# Altium schematic sheet Controls_Architecture.SchDoc
size Letter; SheetNumber: 11; SheetTotal: 13
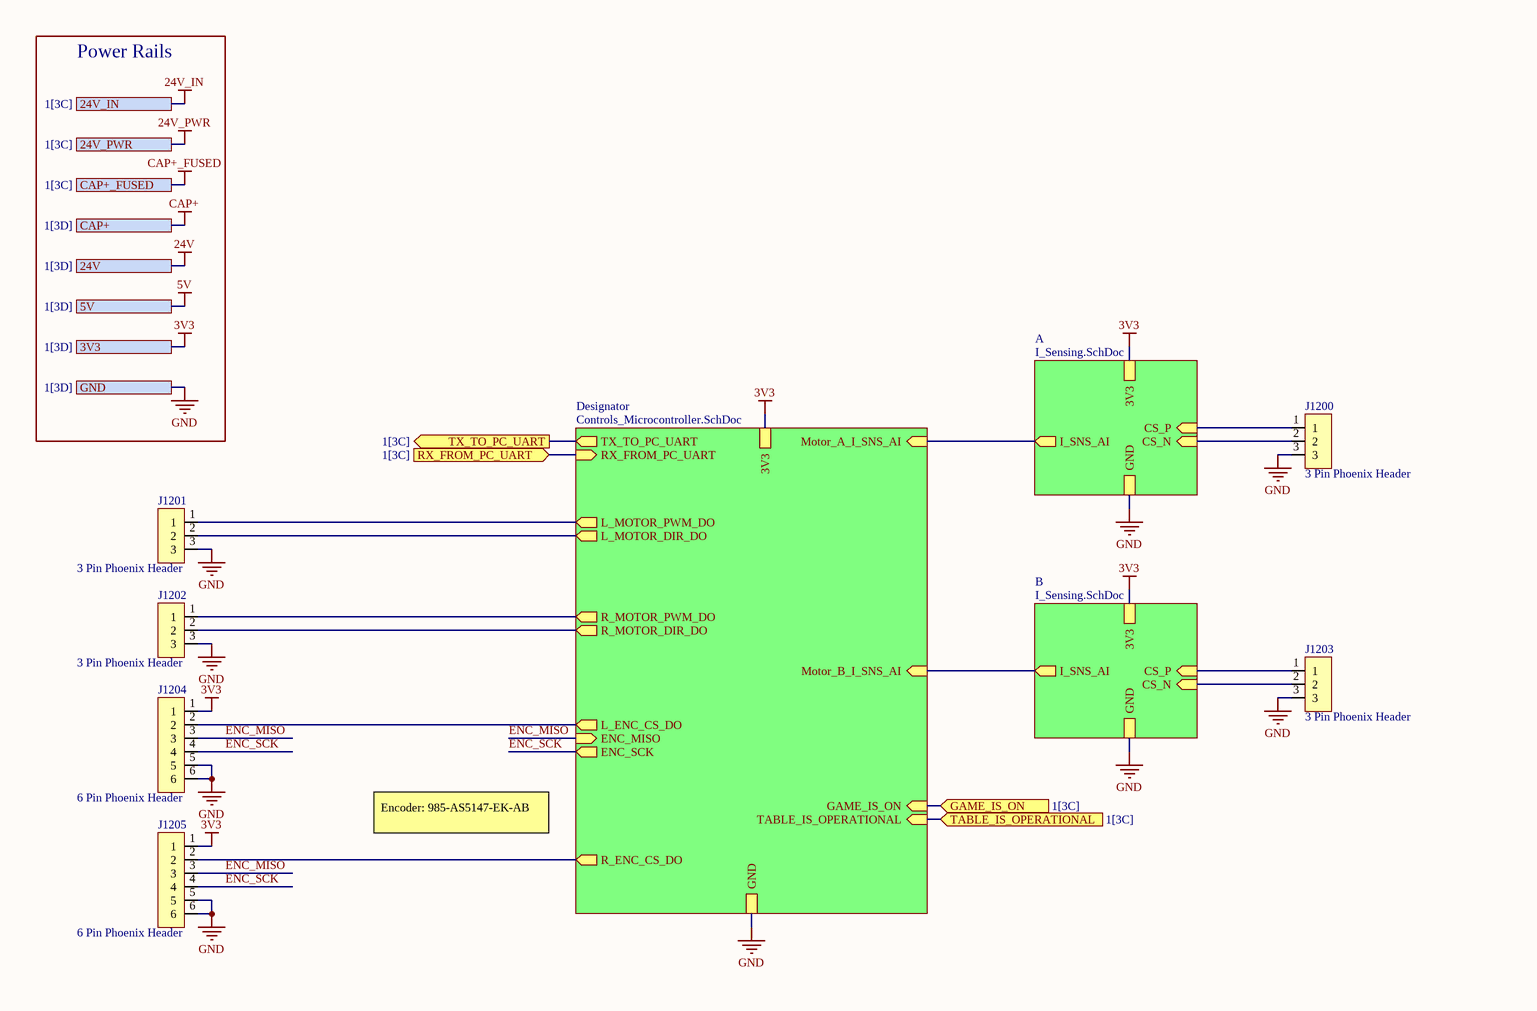
[diagram p0: Controls_Architecture.SchDoc, left]
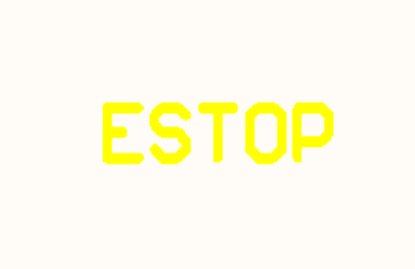
[diagram p1: Controls_Architecture.SchDoc, right]

## Parts
J1200  3 Pin Phoenix Header  [3 Pin Phoenix Header]
J1201  3 Pin Phoenix Header  [3 Pin Phoenix Header]
J1202  3 Pin Phoenix Header  [3 Pin Phoenix Header]
J1203  3 Pin Phoenix Header  [3 Pin Phoenix Header]
J1204  6 Pin Phoenix Header  [6 Pin Phoenix Header]
J1205  6 Pin Phoenix Header  [6 Pin Phoenix Header]

## Sub-sheets
A = I_Sensing.SchDoc: I_SNS_AI (out), CS_P (in), CS_N (in), 3V3, GND
B = I_Sensing.SchDoc: I_SNS_AI (out), CS_P (in), CS_N (in), 3V3, GND
Designator = Controls_Microcontroller.SchDoc: TX_TO_PC_UART (out), RX_FROM_PC_UART (in), Motor_A_I_SNS_AI (in), Motor_B_I_SNS_AI (in), L_MOTOR_PWM_DO (out), L_MOTOR_DIR_DO (out), R_MOTOR_PWM_DO (out), R_MOTOR_DIR_DO (out), ENC_SCK (out), L_ENC_CS_DO (out), R_ENC_CS_DO (out), ENC_MISO (in), GAME_IS_ON (in), TABLE_IS_OPERATIONAL (in), 3V3, GND

## Ports
3V3 (see 1[3D]), 5V (see 1[3D]), 24V (see 1[3D]), 24V_IN (see 1[3C]), 24V_PWR (see 1[3C]), CAP+ (see 1[3D]), CAP+_FUSED (see 1[3C]), GAME_IS_ON (in, see 1[3C]), GND (see 1[3D]), RX_FROM_PC_UART (in, see 1[3C]), TABLE_IS_OPERATIONAL (in, see 1[3C]), TX_TO_PC_UART (out, see 1[3C])

## Nets
3V3: J1204.1 J1205.1 ; port 3V3, sheet Designator/3V3, sheet A/3V3, sheet B/3V3
5V: port 5V
24V: port 24V
24V_IN: port 24V_IN
24V_PWR: port 24V_PWR
CAP+: port CAP+
CAP+_FUSED: port CAP+_FUSED
GND: J1200.3 J1201.3 J1202.3 J1203.3 J1204.5 J1204.6 J1205.5 J1205.6 ; port GND, sheet Designator/GND, sheet A/GND, sheet B/GND
ENC_MISO: J1204.3 J1205.3 ; sheet Designator/ENC_MISO
ENC_SCK: J1204.4 J1205.4 ; sheet Designator/ENC_SCK
GAME_IS_ON: port GAME_IS_ON, sheet Designator/GAME_IS_ON
RX_FROM_PC_UART: port RX_FROM_PC_UART, sheet Designator/RX_FROM_PC_UART
TABLE_IS_OPERATIONAL: port TABLE_IS_OPERATIONAL, sheet Designator/TABLE_IS_OPERATIONAL
TX_TO_PC_UART: port TX_TO_PC_UART, sheet Designator/TX_TO_PC_UART
NetJ1200_1: J1200.1 ; sheet A/CS_P
NetJ1200_2: J1200.2 ; sheet A/CS_N
NetJ1201_1: J1201.1 ; sheet Designator/L_MOTOR_PWM_DO
NetJ1201_2: J1201.2 ; sheet Designator/L_MOTOR_DIR_DO
NetJ1202_1: J1202.1 ; sheet Designator/R_MOTOR_PWM_DO
NetJ1202_2: J1202.2 ; sheet Designator/R_MOTOR_DIR_DO
NetJ1203_1: J1203.1 ; sheet B/CS_P
NetJ1203_2: J1203.2 ; sheet B/CS_N
NetJ1204_2: J1204.2 ; sheet Designator/L_ENC_CS_DO
NetJ1205_2: J1205.2 ; sheet Designator/R_ENC_CS_DO
(unnamed): sheet Designator/Motor_A_I_SNS_AI, sheet A/I_SNS_AI
(unnamed): sheet Designator/Motor_B_I_SNS_AI, sheet B/I_SNS_AI

## Notes on the sheet
- Power Rails
- Encoder: 985-AS5147-EK-AB